# EAGLE schematic sparkfun-samd21-pro-breakout (EAGLE 7.1.0)
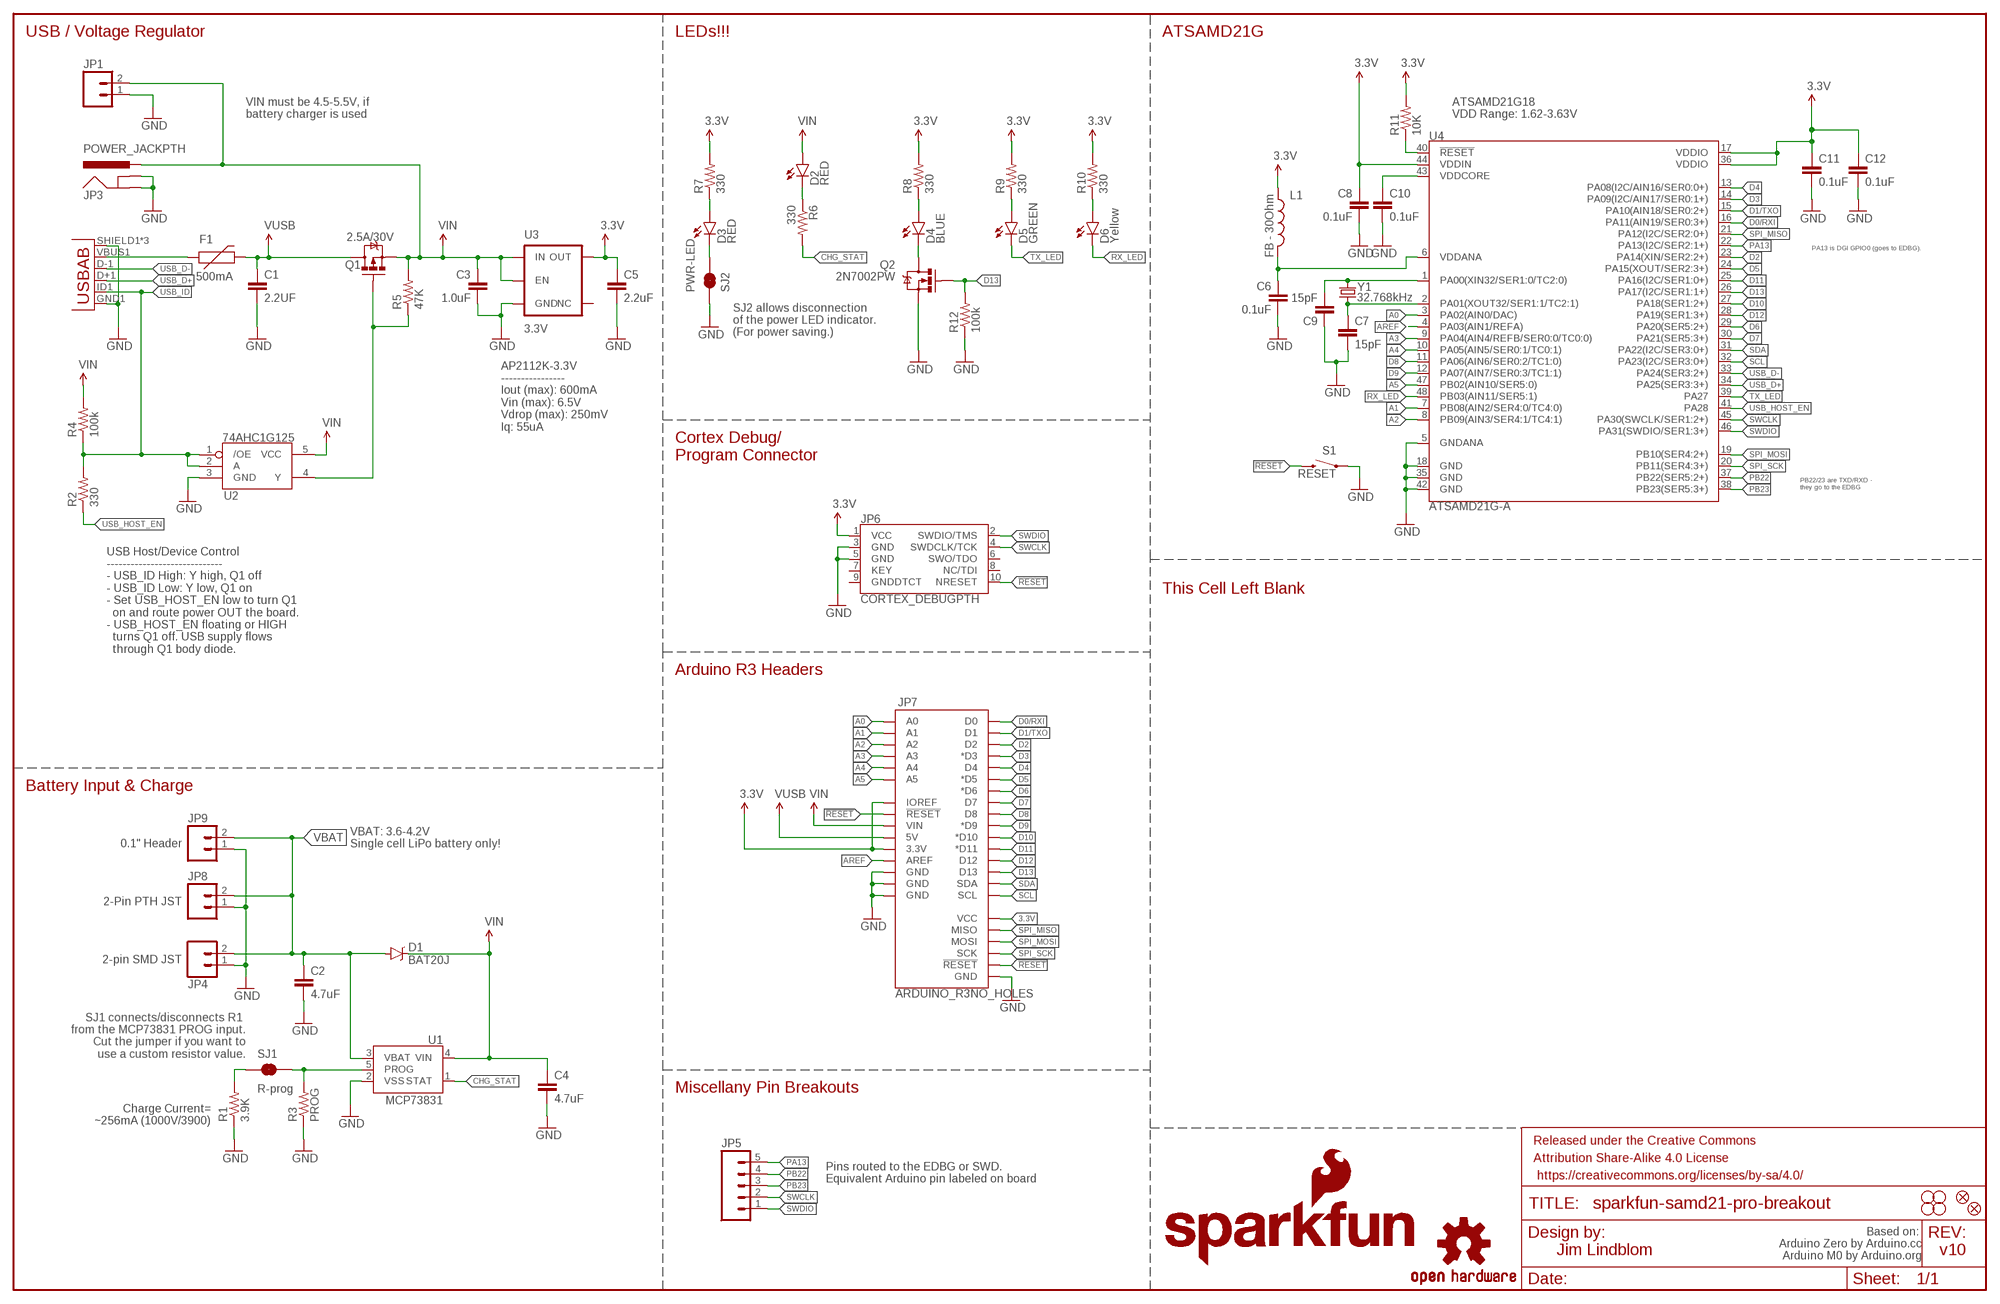
[diagram p0: schematic, sheet 1]

## Parts
C1  2.2UF  2.2UF50V10%(1206)  [1206]
C2  4.7uF  4.7UF-6.3V-10%(0603)0603  [0603-CAP]
C3  1.0uF  1.0UF-25V-+80/-20(0805)"  [0805-CAP]
C4  4.7uF  4.7UF-6.3V-10%(0603)0603  [0603-CAP]
C5  2.2uF  2.2UF-10V-20%(0603)  [0603-CAP]
C6  0.1uF  0.1UF-25V(+80/-20%)(0603)  [0603-CAP]
C7  15pF  15PF-50V-5%(0603)  [0603-CAP]
C8  0.1uF  0.1UF-25V(+80/-20%)(0603)  [0603-CAP]
C9  15pF  15PF-50V-5%(0603)  [0603-CAP]
C10  0.1uF  0.1UF-25V(+80/-20%)(0603)  [0603-CAP]
C11  0.1uF  0.1UF-25V(+80/-20%)(0603)  [0603-CAP]
C12  0.1uF  0.1UF-25V(+80/-20%)(0603)  [0603-CAP]
D1  BAT20J  DIODE-SCHOTTKY-BAT20J  [SOD-323]
D2  RED  LED-RED0603  [LED-0603]
D3  RED  LED-RED0603  [LED-0603]
D4  BLUE  LED-BLUE0603  [LED-0603]
D5  GREEN  LED-GREEN0603  [LED-0603]
D6  Yellow  LED-YELLOW0603  [LED-0603]
F1  500mA  PTCSMD  [PTC-1206]
FID1  FIDUCIAL1X2  [FIDUCIAL-1X2]
FID2  FIDUCIAL1X2  [FIDUCIAL-1X2]
FRAME1  FRAME-LEDGER  [CREATIVE_COMMONS]
JP1  M02PTH  [1X02]
JP2  USB-ABCONN-11794  [USB-AB-MICRO-SMD_V03]
JP3  POWER_JACKPTH  [POWER_JACK_PTH]
JP4  M02-JST-2MM-SMT  [JST-2-SMD]
JP5  M05NO_SILK  [1X05_NO_SILK]
JP6  CORTEX_DEBUGPTH  [2X5-PTH-1.27MM]
JP7  ARDUINO_R3NO_HOLES  [ARDUINO_R3_NO_HOLES]
JP8  M02-JST-2-PTH-NO_SILK  [JST-2-PTH-NS]
JP9  M021X02_NO_SILK  [1X02_NO_SILK]
L1  FB - 30Ohm  INDUCTOR0603  [0603]
LOGO1  SFE_LOGO_NAME_FLAME.2_INCH  [SFE_LOGO_NAME_FLAME_.2]
LOGO2  SFE_LOGO_NAME_FLAME.4_INCH  [SFE_LOGO_NAME_FLAME_.4]
LOGO3  OSHW-LOGOS  [OSHW-LOGO-S]
LOGO4  OSHW-LOGOL  [OSHW-LOGO-L]
Q1  2.5A/30V  MOSFET-PCHANNELDMG2307L  [SOT23-3]
Q2  2N7002PW  MOSFET-NCHANNEL2N7002PW  [SOT323]
R1  3.9K  3.9KOHM1/10W1%(0603)  [0603]
R2  330  330OHM1/10W1%(0603)  [0603-RES]
R3  PROG  RESISTORPTH-1/6W  [1/6W-RES]
R4  100k  100KOHM-1/10W-1%(0603)  [0603-RES]
R5  47K  47KOHM1/10W1%(0603)  [0603-RES]
R6  330  330OHM1/10W1%(0603)  [0603-RES]
R7  330  330OHM1/10W1%(0603)  [0603-RES]
R8  330  330OHM1/10W1%(0603)  [0603-RES]
R9  330  330OHM1/10W1%(0603)  [0603-RES]
R10  330  330OHM1/10W1%(0603)  [0603-RES]
R11  10K  10KOHM-1/10W-1%(0603)0603  [0603-RES]
R12  100k  100KOHM-1/10W-1%(0603)  [0603-RES]
S1  RESET  SWITCH-MOMENTARY-2SMD  [TACTILE-SWITCH-SMD]
SJ1  R-prog  JUMPER-PAD-2-NC_BY_TRACE  [PAD-JUMPER-2-NC_BY_TRACE_YES_SILK]
SJ2  PWR-LED  JUMPER-PAD-2-NC_BY_TRACENO_SILK  [PAD-JUMPER-2-NC_BY_TRACE_NO_SILK]
STANDOFF1  STAND-OFF  [STAND-OFF]
STANDOFF2  STAND-OFF  [STAND-OFF]
STANDOFF3  STAND-OFF  [STAND-OFF]
STANDOFF4  STAND-OFF  [STAND-OFF]
U1  MCP73831  [SOT23-5]
U2  74AHC1G125  [SOT23-5]
U3  3.3V  V_REG_AP2112K-3.3V  [SOT23-5]
U4  ATSAMD21G-A  [TQFP-48]
Y1  32.768kHz  CRYSTAL3.2X1.5MM  [CRYSTAL-SMD-3.2X1.5MM]

## Nets
3.3V: C5.1 C8.1 C11.1 C12.1 JP6.1(VCC) JP7.3.3V JP7.IOREF JP7.VCC L1.1 R7.2 R8.2 R9.2 R10.2 R11.2 U3.5(OUT) U4.17(VDDIO) U4.36(VDDIO) U4.44(VDDIN)
!RESET: JP6.10(NRESET) JP7.RESET@1(!RESET!) JP7.RESET@2(!RESET!) R11.1 S1.3 U4.40(!RESET!)
A0: JP7.A0 U4.3(PA02(AIN0/DAC))
A1: JP7.A1 U4.7(PB08(AIN2/SER4:0/TC4:0))
A2: JP7.A2 U4.8(PB09(AIN3/SER4:1/TC4:1))
A3: JP7.A3 U4.9(PA04(AIN4/REFB/SER0:0/TC0:0))
A4: JP7.A4 U4.10(PA05(AIN5/SER0:1/TC0:1))
A5: JP7.A5 U4.47(PB02(AIN10/SER5:0))
AREF: JP7.AREF U4.4(PA03(AIN1/REFA))
CHG_STAT: R6.2 U1.1(STAT)
D0/RXI: JP7.D0 U4.16(PA11(AIN19/SER0:3+))
D1/TXO: JP7.D1 U4.15(PA10(AIN18/SER0:2+))
D2: JP7.D2 U4.23(PA14(XIN/SER2:2+))
D3: JP7.D3(*D3) U4.14(PA09(I2C/AIN17/SER0:1+))
D4: JP7.D4 U4.13(PA08(I2C/AIN16/SER0:0+))
D5: JP7.D5(*D5) U4.24(PA15(XOUT/SER2:3+))
D6: JP7.D6(*D6) U4.29(PA20(SER5:2+))
D7: JP7.D7 U4.30(PA21(SER5:3+))
D8: JP7.D8 U4.11(PA06(AIN6/SER0:2/TC1:0))
D9: JP7.D9(*D9) U4.12(PA07(AIN7/SER0:3/TC1:1))
D10: JP7.D10(*D10) U4.27(PA18(SER1:2+))
D11: JP7.D11(*D11) U4.25(PA16(I2C/SER1:0+))
D12: JP7.D12 U4.28(PA19(SER1:3+))
D13: JP7.D13 Q2.1(G) R12.2 U4.26(PA17(I2C/SER1:1+))
GND: C1.2 C2.2 C3.2 C4.2 C5.2 C6.2 C7.2 C8.2 C9.1 C10.2 C11.2 C12.2 JP1.1 JP2.GND1(GND) JP2.SHIELD1(SHIELD) JP2.SHIELD2(SHIELD) JP2.SHIELD3(SHIELD) JP3.GND JP3.GNDBREAK JP4.1 JP6.3(GND) JP6.5(GND) JP7.GND@1(GND) JP7.GND@2(GND) JP7.GND@3(GND) JP7.GND@4(GND) JP8.1 JP9.1 Q2.2(S) R1.1 R3.1 R12.1 S1.1 SJ2.1 U1.2(VSS) U2.3(GND) U3.2(GND) U4.5(GNDANA) U4.18(GND) U4.35(GND) U4.42(GND)
N$1: F1.1 JP2.VBUS1(VBUS)
N$2: C9.2 U4.1(PA00(XIN32/SER1:0/TC2:0)) Y1.P$2
N$3: D4.C Q2.3(D)
N$4: C7.1 U4.2(PA01(XOUT32/SER1:1/TC2:1)) Y1.P$1
N$5: D3.A R7.1
N$6: D4.A R8.1
N$8: D2.C R6.1
N$10: D5.A R9.1
N$11: D6.A R10.1
N$12: D3.C SJ2.2
N$13: R1.2 SJ1.1
N$15: R3.2 SJ1.2 U1.5(PROG)
PA13: JP5.5 U4.22(PA13(I2C/SER2:1+))
PB22: JP5.4 U4.37(PB22(SER5:2+))
PB23: JP5.3 U4.38(PB23(SER5:3+))
RX_LED: D6.C U4.48(PB03(AIN11/SER5:1))
SCL: JP7.SCL U4.32(PA23(I2C/SER3:0+))
SDA: JP7.SDA U4.31(PA22(I2C/SER3:0+))
SPI_MISO: JP7.MISO U4.21(PA12(I2C/SER2:0+))
SPI_MOSI: JP7.MOSI U4.19(PB10(SER4:2+))
SPI_SCK: JP7.SCK U4.20(PB11(SER4:3+))
SWCLK: JP5.2 JP6.4(SWDCLK/TCK) U4.45(PA30(SWCLK/SER1:2+))
SWDIO: JP5.1 JP6.2(SWDIO/TMS) U4.46(PA31(SWDIO/SER1:3+))
TX_LED: D5.C U4.39(PA27)
USB_D+: JP2.D+1(D+) U4.34(PA25(SER3:3+))
USB_D-: JP2.D-1(D-) U4.33(PA24(SER3:2+))
USB_HOST_EN: R2.1 U4.41(PA28)
USB_HOST_POWER_EN: Q1.1(G) R5.1 U2.4(Y)
USB_ID: JP2.ID1(USBID) R2.2 R4.1 U2.1(/OE) U2.2(A)
VBAT: C2.1 D1.A JP4.2 JP8.2 JP9.2 U1.3(VBAT)
VDDANA: C6.1 L1.2 U4.6(VDDANA)
VDDCORE: C10.1 U4.43(VDDCORE)
VIN: C3.1 C4.1 D1.C D2.A JP1.2 JP3.PWR JP7.VIN Q1.2(S) R4.2 R5.2 U1.4(VIN) U2.5(VCC) U3.1(IN) U3.3(EN)
VUSB: C1.1 F1.2 JP7.5V Q1.3(D)
Unconnected: JP6.6(SWO/TDO) JP6.7(KEY) JP6.8(NC/TDI) JP6.9(GNDDTCT) U3.4(NC)

## Notes on the sheet
- USB / Voltage Regulator | LEDs!!! | ATSAMD21G
- VIN must be 4.5-5.5V, if 
  battery charger is used
- ATSAMD21G18
  VDD Range: 1.62-3.63V
- PA13 is DGI GPIO0 (goes to EDBG).
- SJ2 allows disconnection
  of the power LED indicator.
  (For power saving.)
- AP2112K-3.3V
  ----------------
  Iout (max): 600mA 
  Vin (max): 6.5V
  Vdrop (max): 250mV
  Iq: 55uA
- Cortex Debug/
  Program Connector
- PB22/23 are TXD/RXD - 
  they go to the EDBG
- USB Host/Device Control
  -----------------------------
  - USB_ID High: Y high, Q1 off
  - USB_ID Low: Y low, Q1 on
  - Set USB_HOST_EN low to turn Q1
    on and route power OUT the board.
  - USB_HOST_EN floating or HIGH
    turns Q1 off. USB supply flows
    through Q1 body diode.
- This Cell Left Blank
- Arduino R3 Headers
- Battery Input & Charge
- VBAT: 3.6-4.2V
  Single cell LiPo battery only\!
- 0.1" Header
- 2-Pin PTH JST
- 2-pin SMD JST
- SJ1 connects/disconnects R1 
  from the MCP73831 PROG input.
  Cut the jumper if you want to
  use a custom resistor value.
- Miscellany Pin Breakouts
- Charge Current=
  ~256mA (1000V/3900)
- Pins routed to the EDBG or SWD.
  Equivalent Arduino pin labeled on board
- Based on: 
  Arduino Zero by Arduino.cc
  Arduino M0 by Arduino.org
- Jim Lindblom | v10

## Library data of the parts
C1 = SparkFun-Capacitors:2.2UF50V10%(1206): CAP-10009; PROD_ID: CAP-10009
C2 C4 = SparkFun-Capacitors:4.7UF-6.3V-10%(0603): CAP-08280; PROD_ID: CAP-08280
C3 = SparkFun-Capacitors:1.0UF-25V-+80/-20(0805): CAP-11625; PROD_ID: CAP-11625
C5 = SparkFun-Capacitors:2.2UF-10V-20%(0603): CAP-07888; PROD_ID: CAP-07888
C6 C8 C10-C12 = SparkFun-Capacitors:0.1UF-25V(+80/-20%)(0603): CAP-00810 Ceramic Standard decoupling cap; PROD_ID: CAP-00810
C7 C9 = SparkFun-Capacitors:15PF-50V-5%(0603): CAP-07881; PROD_ID: CAP-07881
D1 = SparkFun-DiscreteSemi:DIODE-SCHOTTKY: Schottky diodes in SFE's production catalog BAT20J 1A 23V 0.62Vf RB751 120mA 40V 0.37Vf PMEG4005EJ 0.5A 40V 0.42Vf MBRA140 1A 40V 0.5Vf B340A 3A 40V SMA; PROD_ID: DIO-11623
D2 D3 = SparkFun-LED:LED-RED: Assorted Red LEDs LilyPad 1206- DIO-09912 1206- DIO-00809 0603- DIO-00819 "SMART" means more efficient and expensive; PROD_ID: DIO-00819
D4 = SparkFun-LED:LED-BLUE: Blue LEDs for production use Various blue LEDs stocked by SparkFun production 0603 - DIO-08575 Rebel - DIO-09553 1206 - DIO-09911; PROD_ID: DIO-08575
D5 = SparkFun-LED:LED-GREEN: Various green LEDs Green LEDs used in SFE Production 0603- DIO-00821 LARGE- DIO-00862 LILYPAD- DIO-09910; PROD_ID: DIO-00821
D6 = SparkFun-LED:LED-YELLOW: Yellow SMD LEDs LilyPad 1206- DIO-09909 0603- DIO-09003 "SMART" means more efficient and expensive; PROD_ID: DIO-09003
F1 = SparkFun-PowerIC:PTC: Resettable Fuse PTC Resettable Fuse. Spark Fun Electronics SKU : COM-08357; PROD_ID: RES-11150
FID1 FID2 = SparkFun-Aesthetics:FIDUCIAL: Fiducial Alignment Points Various fiducial points for machine vision alignment.
FRAME1 = SparkFun-Aesthetics:FRAME-LEDGER: Schematic Frame Standard 11x14 US Ledger frame
JP1 JP8 JP9 = SparkFun-Connectors:M02: Standard 2-pin 0.1" header. Use with - straight break away headers ( PRT-00116) - right angle break away headers (PRT-00553) - swiss pins (PRT-00743) - machine pins (PRT-00117) - female headers (PRT-00115) Molex polarized connector foot print use with: PRT-08233 with associated crimp pins and housings. 2.54_SCREWTERM for use with PRT-10571. 3.5mm Screw Terminal footprints for PRT-08084 5mm Screw Terminal footprints for use with PRT-08432
JP2 = SparkFun-Connectors:USB-AB: This is a USB AB connector that is compatible with USB OTG. i.e. this connector can serve as a host or device; PROD_ID: CONN-11794
JP3 = SparkFun-Connectors:POWER_JACK: Power Jack This is the standard 5.5mm barrel jack for power. The PTH is the most common, proven, reliable, footprint. The Slot footprint only works if the mill layer is transmitted to the PCB fab house so be warned. Mating wall wart : TOL-00298 (and others); PROD_ID: CONN-08197
JP4 = SparkFun-Connectors:M02: Standard 2-pin 0.1" header. Use with - straight break away headers ( PRT-00116) - right angle break away headers (PRT-00553) - swiss pins (PRT-00743) - machine pins (PRT-00117) - female headers (PRT-00115) Molex polarized connector foot print use with: PRT-08233 with associated crimp pins and housings. 2.54_SCREWTERM for use with PRT-10571. 3.5mm Screw Terminal footprints for PRT-08084 5mm Screw Terminal footprints for use with PRT-08432; PROD_ID: CONN-11443
JP5 = SparkFun-Connectors:M05: Header 5 Standard 5-pin 0.1" header. Use with straight break away headers (SKU : PRT-00116), right angle break away headers (PRT-00553), swiss pins (PRT-00743), machine pins (PRT-00117), and female headers (PRT-00115). Molex polarized connector foot print use with SKU : PRT-08230 with associated crimp pins and housings.
JP6 = samd21-temp:CORTEX_DEBUG: Cortex Debug Connector Datasheet <http://infocenter.arm.com/help/topic/com.arm.doc.faqs/attached/13634/cortex_debug_connectors.pdf>
JP7 = SparkFun-Boards:ARDUINO_R3: Arduino R3 Footprint (w/ SPI header)
L1 = SparkFun-Passives:INDUCTOR: Inductors Basic Inductor/Choke - 0603 and 1206. Footprints are not proven and vary greatly between part numbers. INDUCTOR POWER 3.3UH 4.0A SMD 0.197" L x 0.197" W x 0.177" H (5.00mm x 5.00mm x 4.50mm); PROD_ID: RES-07859
LOGO1 LOGO2 = SparkFun-Aesthetics:SFE_LOGO_NAME_FLAME: SFE Logo, name and flame This is the SparkFun full logo. The logo on the schematic will always be the same size; the package variant is the height of the flame part of the logo. Default layer for the logo on the board is tSilk.
LOGO3 LOGO4 = SparkFun-Aesthetics:OSHW-LOGO: Open Source Hardware Logo This logo indicates the piece of hardware it is found on incorporates a OSHW license and/or adheres to the definition of open source hardware found here: http://freedomdefined.org/OSHW
Q1 = SparkFun-DiscreteSemi:MOSFET-PCHANNEL: Generic PMOSFET IRLML2244 - TRANS-11153 (SOT-23 -20V -4.3A) (1.Gate 2.Source 3.Drain) FQP27P06 - COM-10349 <http://www.sparkfun.com/products/10349> (TO-220 -60V -27A) (1.Gate 2.Source 3.Drain); PROD_ID: TRANS-11308
Q2 = SparkFun-DiscreteSemi:MOSFET-NCHANNEL: Common NMOSFET Parts MFG P/N Store ID Prod ID FDD8780 TRANS-09984 SI7820DN TRANS-11055 FDS6630A IC-08089 2N7002PW TRANS-11151 FQP30N06L COM-10213 TRANS-10060 BSS123LT1G TRANS-08345 BSS138 TRANS-00830 BS170 2N7000; PROD_ID: TRANS-11151
R1 = SparkFun-Resistors:3.9KOHM1/10W1%(0603): RES-08701; PROD_ID: RES-08701
R2 R6-R10 = SparkFun-Resistors:330OHM1/10W1%(0603): RES-00818; PROD_ID: RES-00818
R3 = SparkFun-Passives:RESISTOR: Resistor Basic schematic elements and footprints for 0603, 1206, and PTH resistors.
R4 R12 = SparkFun-Resistors:100KOHM-1/10W-1%(0603): RES-07828; PROD_ID: RES-07828
R5 = SparkFun-Resistors:47KOHM1/10W1%(0603): RES-07871; PROD_ID: RES-07871
R11 = SparkFun-Resistors:10KOHM-1/10W-1%(0603): RES-00824; PROD_ID: RES-00824
S1 = SparkFun-Electromechanical:SWITCH-MOMENTARY-2: Various NO switches- pushbuttons, reed, etc; PROD_ID: SWCH-08247
SJ1 SJ2 = SparkFun-Passives:JUMPER-PAD-2-NC_BY_TRACE
STANDOFF1-STANDOFF4 = SparkFun-Electromechanical:STAND-OFF: #4 Stand Off This is the mechanical footprint for a #4 phillips button head screw. Use the keepout ring to avoid running the screw head into surrounding components. SKU : PRT-00447
U1 = SparkFun-PowerIC:MCP73831: Miniature single cell, fully integrated Li-Ion, Li-polymer charge management controller http://ww1.microchip.com/downloads/en/DeviceDoc/20001984g.pdf IC-09995; PROD_ID: IC-09995
U2 = SparkFun-DigitalIC:74AHC1G125: Single bus buffer gate with 3-state output; PROD_ID: IC-11920
U3 = SparkFun-PowerIC:V_REG_AP2112: AP2112 - 600mA CMOS LDO Regulator w/ Enable The AP2112 is CMOS process low dropout linear regulator with enable function, the regulator delivers a guaranteed 600mA (min.) continuous load current. Features Output Voltage Accuracy: ±1.5% Output Current: 600mA (Min.) Foldback Short Current Protection: 50mA Enable Function to Turn ON/OFF VOUT Low Dropout Voltage (3.3V): 250mV (Typ.) @IOUT=600mA Excellent Load Regulation: 0.2%/A (Typ.) Excellent Line Regulation: 0.02%/V (Typ.) Low Quiescent Current: 55μA (Typ.) Low Standby Current: 0.01μA (Typ.) Low Output Noise: 50μVRMS PSRR: 100Hz -65dB, 1kHz -65dB OTSD Protection Stable with 1.0μF Flexible Cap: Ceramic, Tantalum and Aluminum Electrolytic Operation Temperature Range: -40°C to 85°C ESD: MM 400V, HBM 4000V; PROD_ID: VREG-12457
U4 = samd21-temp:ATSAMD21G: Atmel SAMD21G SMART ARM-Based Microcontroller The Atmel ® | SMART ™ SAM D21 is a series of low-power microcontrollers using the 32-bit ARM ® Cortex ® -M0+ processor, and ranging from 32- to 64-pins with up to 256KB Flash and 32KB of SRAM. The SAM D21 devices operate at a maximum frequency of 48MHz and reach 2.46 CoreMark/MHz. They are designed for simple and intuitive migration with identical peripheral modules, hex compatible code, identical linear address map and pin compatible migration paths between all devices in the product series. All devices include intelligent and flexible peripherals, Atmel Event System for inter-peripheral signaling, and support for capacitive touch button, slider and wheel user interfaces.; PROD_ID: IC-13064
Y1 = samd21-temp:CRYSTAL: Various standard crystals. Proven footprints.; PROD_ID: XTAL-13062